# EAGLE design mp3-trigger (EAGLE 7.2.0)

## Sheet 1 of 2
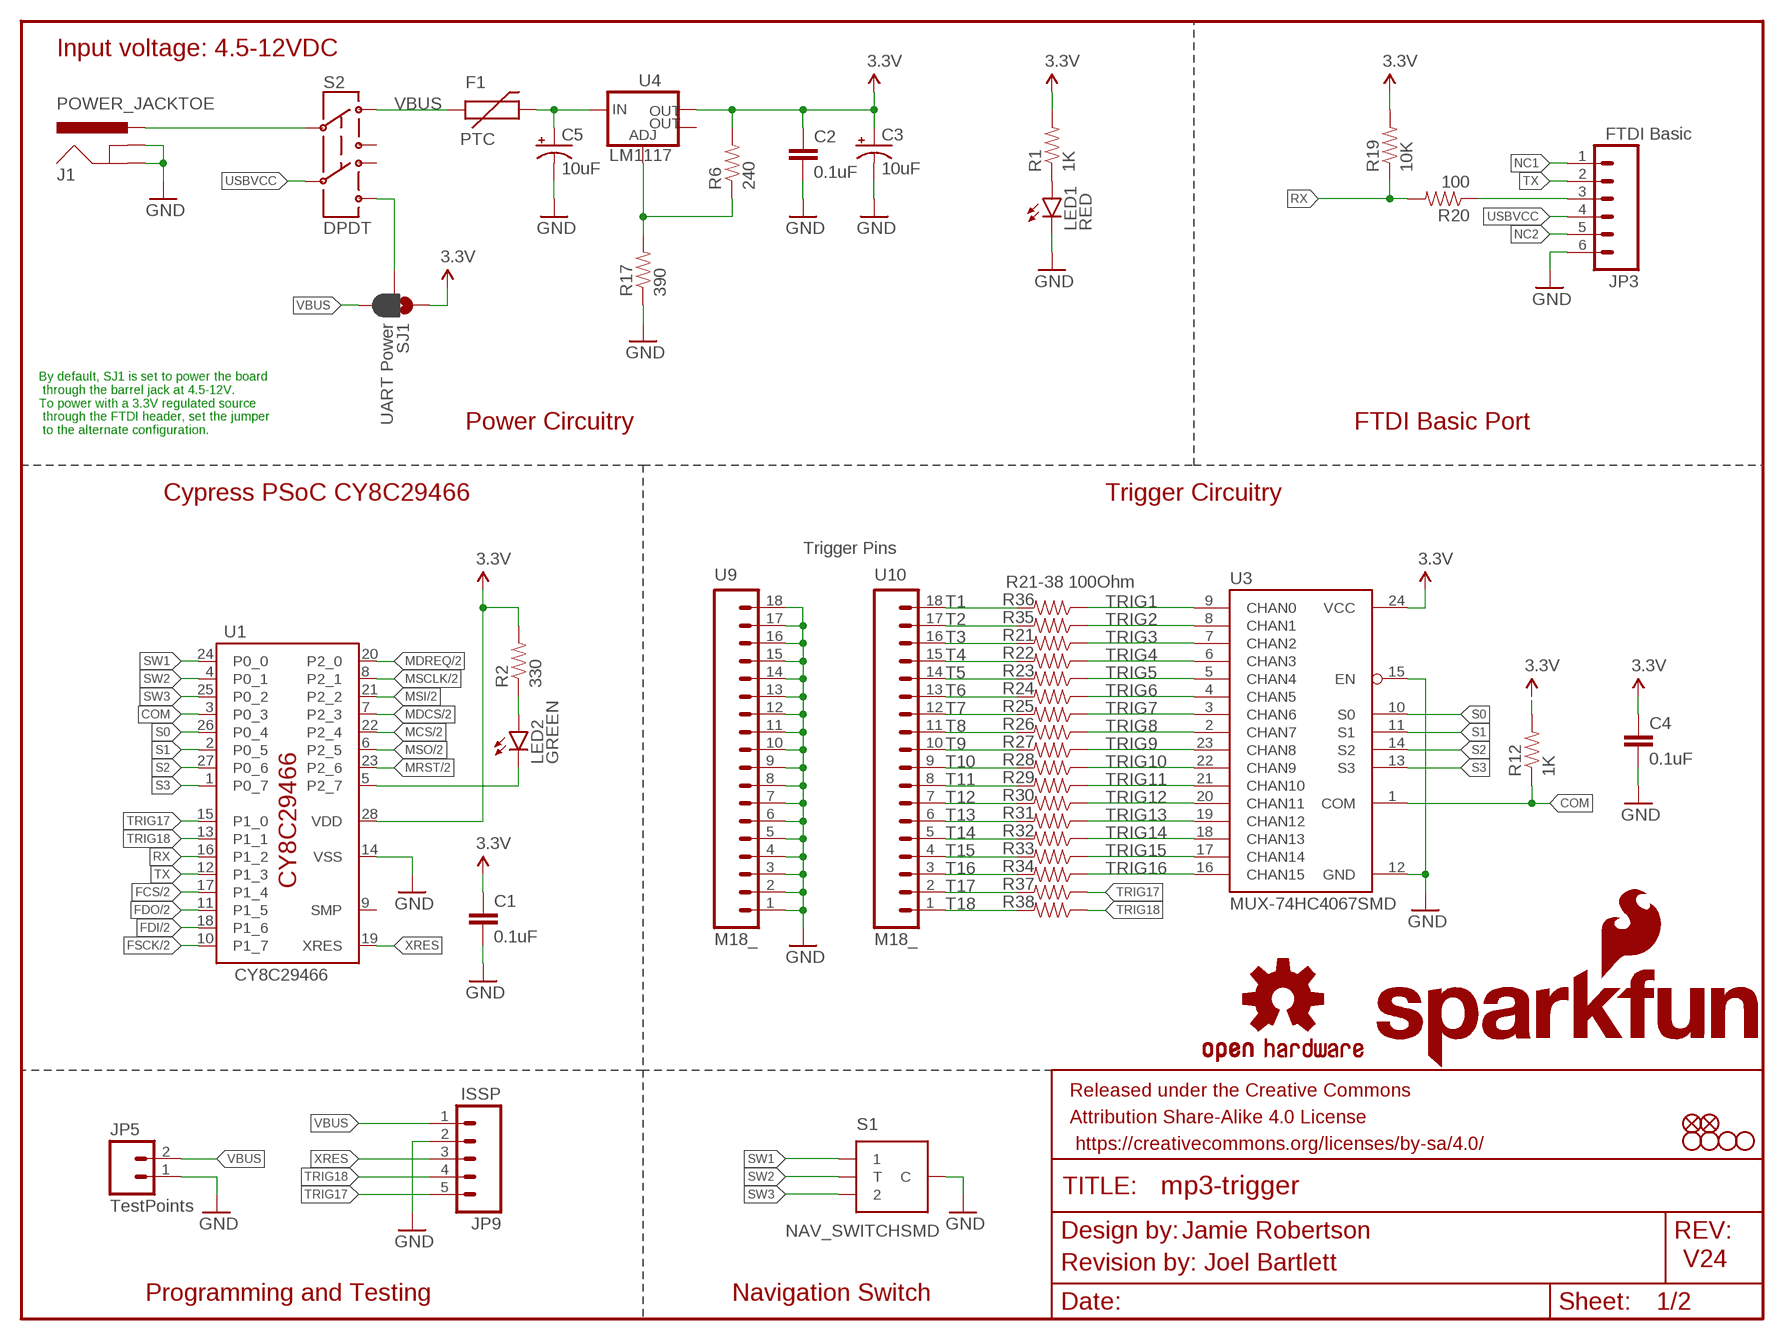
[diagram p0: schematic, sheet 1]

### Parts
C1  0.1uF  0.1UF-25V(+80/-20%)(0603)  [0603-CAP]
C2  0.1uF  0.1UF-25V(+80/-20%)(0603)  [0603-CAP]
C3  10uF  10UF-16V-10%(TANT)  [EIA3216]
C4  0.1uF  0.1UF-25V(+80/-20%)(0603)  [0603-CAP]
C5  10uF  10UF-16V-10%(TANT)  [EIA3216]
F1  PTC  PTCTHERMISTOR1206  [PTC-1206]
FRAME3  FRAME-LETTER  [CREATIVE_COMMONS]
J1  POWER_JACKTOE  [POWER_JACK_SMD_OVERPASTE_TOE]
JP3  FTDI Basic  M06SIP  [1X06]
JP5  TestPoints  M02PTH  [1X02]
JP6  FIDUCIAL1X2  [FIDUCIAL-1X2]
JP7  FIDUCIAL1X2  [FIDUCIAL-1X2]
JP9  ISSP  M05PTH  [1X05]
LED1  RED  LED-RED1206  [LED-1206]
LED2  GREEN  LED-GREEN1206  [LED-1206]
LOGO3  OSHW-LOGOM  [OSHW-LOGO-M]
R1  1K  1KOHM-1/10W-1%(0603)  [0603-RES]
R2  330  330OHM1/10W1%(0603)  [0603-RES]
R6  240  240OHM1/10W1%(0603)  [0603-RES]
R12  1K  1KOHM-1/10W-1%(0603)  [0603-RES]
R17  390  390OHM1/10W1%(0603)  [0603-RES]
R19  10K  10KOHM-1/10W-1%(0603)0603  [0603-RES]
R20  100  100OHM-1/10W-1%(0603)  [0603-RES]
R21  100  100OHM-1/10W-1%(0603)  [0603-RES]
R22  100  100OHM-1/10W-1%(0603)  [0603-RES]
R23  100  100OHM-1/10W-1%(0603)  [0603-RES]
R24  100  100OHM-1/10W-1%(0603)  [0603-RES]
R25  100  100OHM-1/10W-1%(0603)  [0603-RES]
R26  100  100OHM-1/10W-1%(0603)  [0603-RES]
R27  100  100OHM-1/10W-1%(0603)  [0603-RES]
R28  100  100OHM-1/10W-1%(0603)  [0603-RES]
R29  100  100OHM-1/10W-1%(0603)  [0603-RES]
R30  100  100OHM-1/10W-1%(0603)  [0603-RES]
R31  100  100OHM-1/10W-1%(0603)  [0603-RES]
R32  100  100OHM-1/10W-1%(0603)  [0603-RES]
R33  100  100OHM-1/10W-1%(0603)  [0603-RES]
R34  100  100OHM-1/10W-1%(0603)  [0603-RES]
R35  100  100OHM-1/10W-1%(0603)  [0603-RES]
R36  100  100OHM-1/10W-1%(0603)  [0603-RES]
R37  100  100OHM-1/10W-1%(0603)  [0603-RES]
R38  100  100OHM-1/10W-1%(0603)  [0603-RES]
S1  NAV_SWITCHSMD  [NAV_SWITCH]
S2  DPDT  SWITCH-DPDTAYZ0202  [AYZ0202]
SJ1  UART Power  JUMPER-PAD-3-2OF3_NC_BY_PASTE  [PAD-JUMPER-3-2OF3_NC_BY_PASTE_YES_SILK_FULL_BOX]
U1  CY8C29466  CY8C29466-24  [SOIC-28]
U3  MUX-74HC4067SMD  [SSOP24]
U4  LM1117  V_REG_LM1117SOT223  [SOT223]
U9  M18_  [1X18]
U10  M18_  [1X18]
U$1  SFE_LOGO_NAME_FLAME.2_INCH  [SFE_LOGO_NAME_FLAME_.2]
U$12  STAND-OFF  [STAND-OFF]
U$13  STAND-OFF  [STAND-OFF]
U$14  STAND-OFF  [STAND-OFF]
U$15  STAND-OFF  [STAND-OFF]

### Nets
3.3V: C1.1 C2.1 C3.A(+) C4.1 R1.2 R2.2 R6.2 R12.2 R19.2 SJ1.1 U1.28(VDD) U3.24(VCC) U4.2(OUT) ; also sheet 2
COM: R12.1 U1.3(P0_3) U3.1(COM)
FCS: U1.17(P1_4) ; also sheet 2
FDI: U1.18(P1_6) ; also sheet 2
FDO: U1.11(P1_5) ; also sheet 2
FSCK: U1.10(P1_7) ; also sheet 2
GND: C1.2 C2.2 C3.C(-) C4.2 C5.C(-) J1.GND(GNDBREAK) J1.P$4(GND) JP3.6 JP5.1 JP9.2 LED1.C R17.1 S1.C U1.14(VSS) U3.12(GND) U3.15(EN) U9.1 U9.2 U9.3 U9.4 U9.5 U9.6 U9.7 U9.8 U9.9 U9.10 U9.11 U9.12 U9.13 U9.14 U9.15 U9.16 U9.17 U9.18 ; also sheet 2
MCS: U1.22(P2_4) ; also sheet 2
MDCS: U1.7(P2_3) ; also sheet 2
MDREQ: U1.20(P2_0) ; also sheet 2
MRST: U1.23(P2_6) ; also sheet 2
MSCLK: U1.8(P2_1) ; also sheet 2
MSI: U1.21(P2_2) ; also sheet 2
MSO: U1.6(P2_5) ; also sheet 2
N$2: R6.1 R17.2 U4.1(ADJ)
N$4: LED1.A R1.1
N$9: LED2.A R2.1
N$12: LED2.C U1.5(P2_7)
N$13: J1.VIN0(PWR) S2.2
N$18: C5.A(+) F1.2 U4.3(IN)
N$20: S2.6 SJ1.2
NC1: JP3.1
NC2: JP3.5
RX: R19.1 R20.2 U1.16(P1_2)
RX-I: JP3.3 R20.1
S0: U1.26(P0_4) U3.10(S0)
S1: U1.2(P0_5) U3.11(S1)
S2: U1.27(P0_6) U3.14(S2)
S3: U1.1(P0_7) U3.13(S3)
SW1: S1.1 U1.24(P0_0)
SW2: S1.T U1.4(P0_1)
SW3: S1.2 U1.25(P0_2)
T1: R36.2 U10.18
T2: R35.2 U10.17
T3: R21.2 U10.16
T4: R22.2 U10.15
T5: R23.2 U10.14
T6: R24.2 U10.13
T7: R25.2 U10.12
T8: R26.2 U10.11
T9: R27.2 U10.10
T10: R28.2 U10.9
T11: R29.2 U10.8
T12: R30.2 U10.7
T13: R31.2 U10.6
T14: R32.2 U10.5
T15: R33.2 U10.4
T16: R34.2 U10.3
T17: R37.2 U10.2
T18: R38.2 U10.1
TRIG1: R36.1 U3.9(CHAN0)
TRIG2: R35.1 U3.8(CHAN1)
TRIG3: R21.1 U3.7(CHAN2)
TRIG4: R22.1 U3.6(CHAN3)
TRIG5: R23.1 U3.5(CHAN4)
TRIG6: R24.1 U3.4(CHAN5)
TRIG7: R25.1 U3.3(CHAN6)
TRIG8: R26.1 U3.2(CHAN7)
TRIG9: R27.1 U3.23(CHAN8)
TRIG10: R28.1 U3.22(CHAN9)
TRIG11: R29.1 U3.21(CHAN10)
TRIG12: R30.1 U3.20(CHAN11)
TRIG13: R31.1 U3.19(CHAN12)
TRIG14: R32.1 U3.18(CHAN13)
TRIG15: R33.1 U3.17(CHAN14)
TRIG16: R34.1 U3.16(CHAN15)
TRIG17: JP9.5 R37.1 U1.15(P1_0)
TRIG18: JP9.4 R38.1 U1.13(P1_1)
TX: JP3.2 U1.12(P1_3)
USBVCC: JP3.4 S2.5
VBUS: F1.1 JP5.2 JP9.1 S2.1 SJ1.3
XRES: JP9.3 U1.19(XRES)
Unconnected: S2.3 S2.4 U1.9(SMP) U4.4(OUT)

### Notes on the sheet
- Input voltage: 4.5-12VDC
- Power Circuitry | FTDI Basic Port
- By default, SJ1 is set to power the board
   through the barrel jack at 4.5-12V. 
  To power with a 3.3V regulated source
   through the FTDI header, set the jumper
   to the alternate configuration.
- Cypress PSoC CY8C29466 | Trigger Circuitry
- Trigger Pins
- R21-38 100Ohm
- Jamie Robertson
- Revision by: Joel Bartlett | V24
- Programming and Testing | Navigation Switch

## Sheet 2 of 2
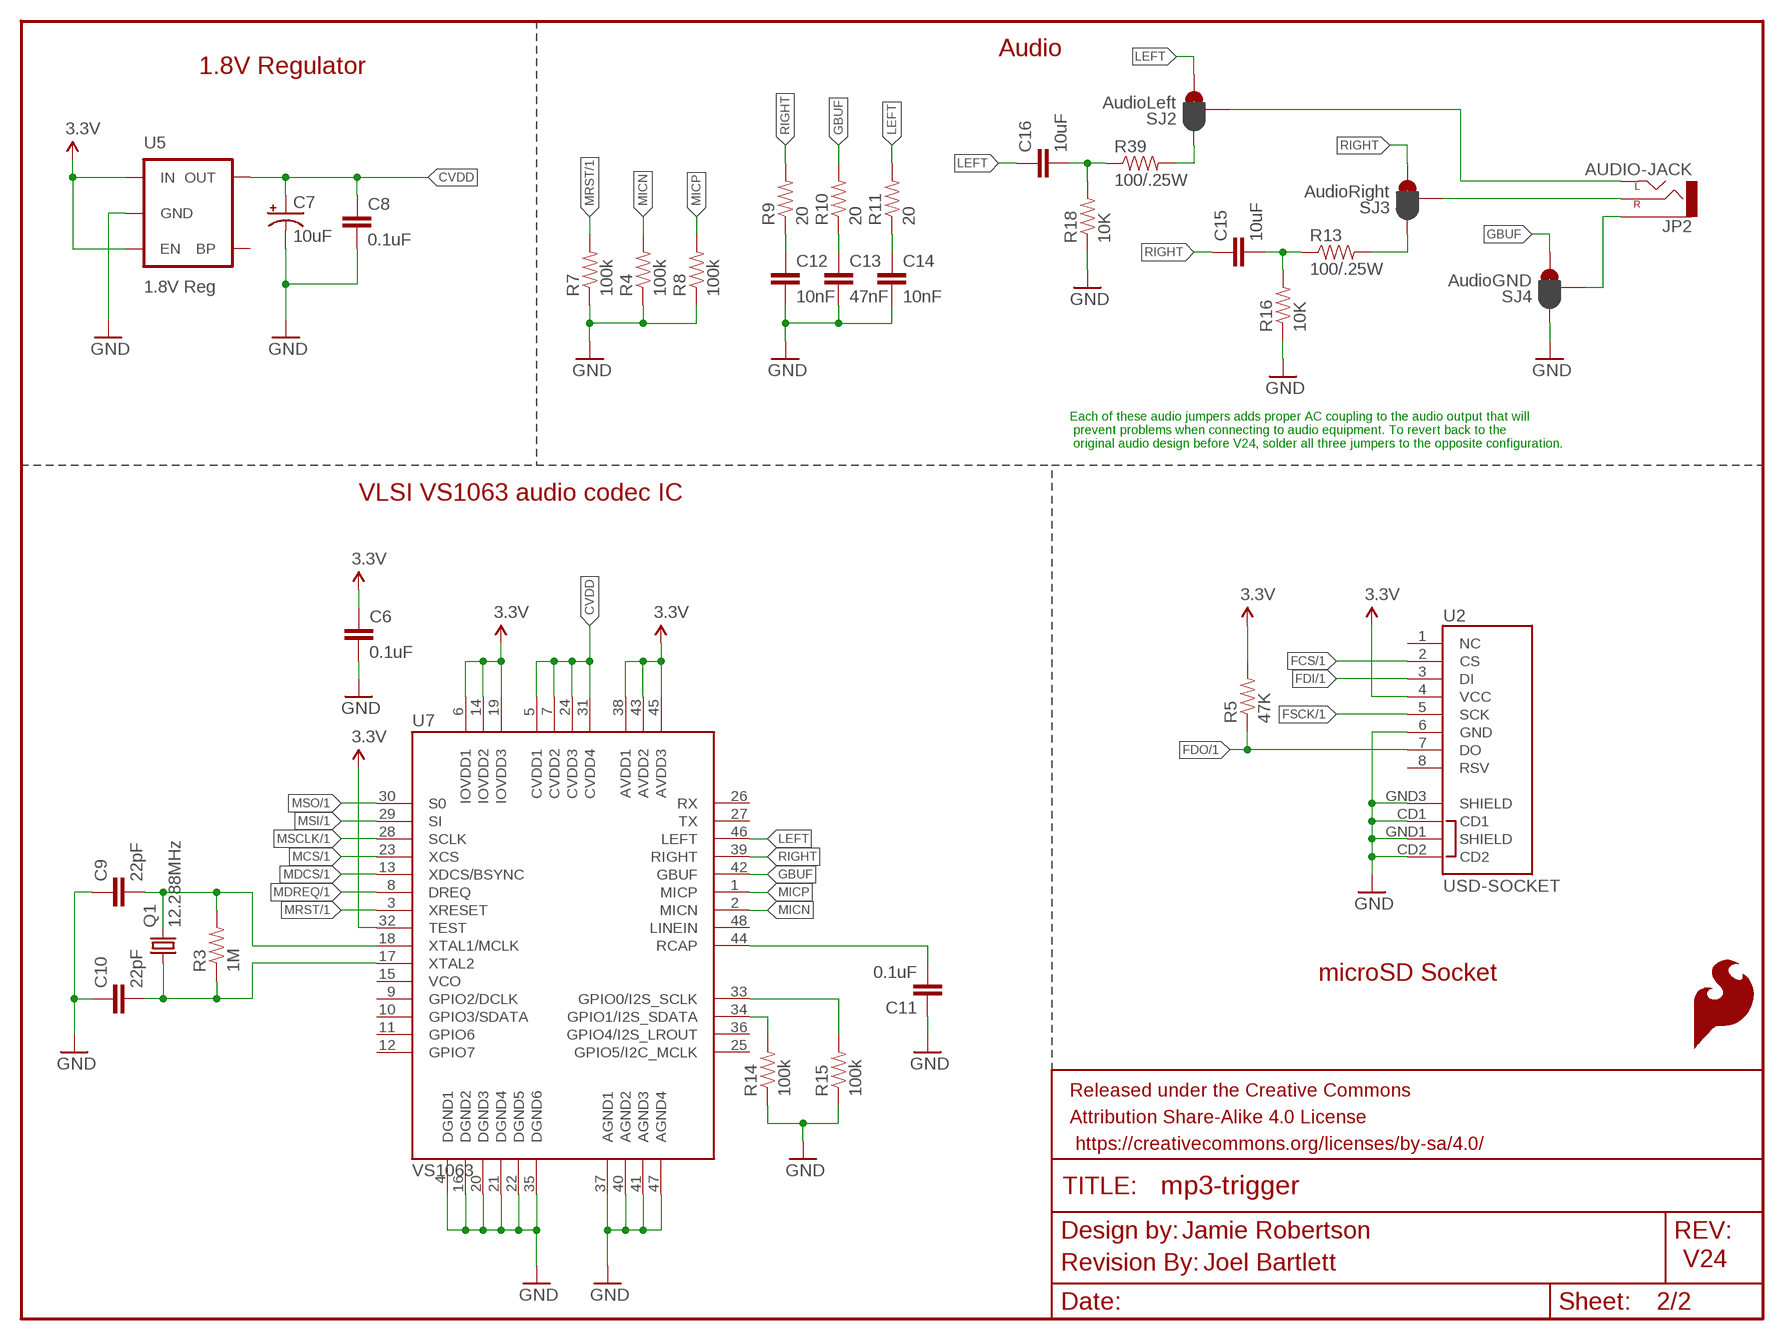
[diagram p1: schematic, sheet 2]

### Parts
C6  0.1uF  0.1UF-25V(+80/-20%)(0603)  [0603-CAP]
C7  10uF  10UF-16V-10%(TANT)  [EIA3216]
C8  0.1uF  0.1UF-25V(+80/-20%)(0603)  [0603-CAP]
C9  22pF  22PF-50V-5%(0603)  [0603-CAP]
C10  22pF  22PF-50V-5%(0603)  [0603-CAP]
C11  0.1uF  0.1UF-25V(+80/-20%)(0603)  [0603-CAP]
C12  10nF  10NF/10000PF-50V-10%(0603)  [0603-CAP]
C13  47nF  47NF(0.047UF/47000PF)-25V-5%(0603)SMD  [0603-CAP]
C14  10nF  10NF/10000PF-50V-10%(0603)  [0603-CAP]
C15  10uF  10UF-6.3V-20%(0603)  [0603-CAP]
C16  10uF  10UF-6.3V-20%(0603)  [0603-CAP]
FRAME1  FRAME-LETTERNO_PACKAGE  [DUMMY]
JP2  AUDIO-JACK  AUDIO-JACKSMD2  [AUDIO-JACK-3.5MM-SMD]
LOGO1  SFE_LOGO_FLAME.3_INCH  [SFE_LOGO_FLAME_.3]
Q1  12.288MHz  CRYSTALCRYSTAL-SMD-5X3-12.288MHZ  [CRYSTAL-SMD-5X3]
R3  1M  1MOHM-1/10W-1%(0603)  [0603-RES]
R4  100k  100KOHM-1/10W-1%(0603)  [0603-RES]
R5  47K  47KOHM1/10W1%(0603)  [0603-RES]
R7  100k  100KOHM-1/10W-1%(0603)  [0603-RES]
R8  100k  100KOHM-1/10W-1%(0603)  [0603-RES]
R9  20  20OHM1/10W1%(0603)SMD  [0603-RES]
R10  20  20OHM1/10W1%(0603)SMD  [0603-RES]
R11  20  20OHM1/10W1%(0603)SMD  [0603-RES]
R13  100/.25W  100OHM-1/4W-5%(0603)  [0603-RES]
R14  100k  100KOHM-1/10W-1%(0603)  [0603-RES]
R15  100k  100KOHM-1/10W-1%(0603)  [0603-RES]
R16  10K  10KOHM-1/10W-1%(0603)0603  [0603-RES]
R18  10K  10KOHM-1/10W-1%(0603)0603  [0603-RES]
R39  100/.25W  100OHM-1/4W-5%(0603)  [0603-RES]
SJ2  AudioLeft  JUMPER_PAD-3-1&2_NC_BY_PASTE  [PAD-HUMPER-3-1&2_NC_BY_PASTE_YES_SILK_FULL_BOX]
SJ3  AudioRight  JUMPER_PAD-3-1&2_NC_BY_PASTE  [PAD-HUMPER-3-1&2_NC_BY_PASTE_YES_SILK_FULL_BOX]
SJ4  AudioGND  JUMPER_PAD-3-1&2_NC_BY_PASTE  [PAD-HUMPER-3-1&2_NC_BY_PASTE_YES_SILK_FULL_BOX]
U2  USD-SOCKET  [MICROSD_1:1]
U5  1.8V Reg  V_REG_LDOSMD2  [SC70]
U7  VS1063  VS1063SMD  [LQFP-48]
U$4  REVISION  [REVISION]

### Nets
3.3V: C6.1 R5.2 U2.4(VCC) U5.1(IN) U5.3(EN) U7.6(IOVDD1) U7.14(IOVDD2) U7.19(IOVDD3) U7.32(TEST) U7.38(AVDD1) U7.43(AVDD2) U7.45(AVDD3) ; also sheet 1
CVDD: C7.A(+) C8.1 U5.5(OUT) U7.5(CVDD1) U7.7(CVDD2) U7.24(CVDD3) U7.31(CVDD4)
FCS: U2.2(CS) ; also sheet 1
FDI: U2.3(DI) ; also sheet 1
FDO: R5.1 U2.7(DO) ; also sheet 1
FSCK: U2.5(SCK) ; also sheet 1
GBUF: R10.2 SJ4.3 U7.42(GBUF)
GND: C6.2 C7.C(-) C8.2 C9.1 C10.1 C11.1 C12.2 C13.2 C14.2 R4.1 R7.1 R8.1 R14.1 R15.1 R16.1 R18.1 SJ4.1 U2.6(GND) U2.CD1 U2.CD2 U2.GND1(SHIELD) U2.GND3(SHIELD) U5.2(GND) U7.4(DGND1) U7.16(DGND2) U7.20(DGND3) U7.21(DGND4) U7.22(DGND5) U7.35(DGND6) U7.37(AGND1) U7.40(AGND2) U7.41(AGND3) U7.47(AGND4) ; also sheet 1
LEFT: C16.1 R11.2 SJ2.3 U7.46(LEFT)
MCS: U7.23(XCS) ; also sheet 1
MDCS: U7.13(XDCS/BSYNC) ; also sheet 1
MDREQ: U7.8(DREQ) ; also sheet 1
MICN: R4.2 U7.2(MICN)
MICP: R8.2 U7.1(MICP)
MRST: R7.2 U7.3(XRESET) ; also sheet 1
MSCLK: U7.28(SCLK) ; also sheet 1
MSI: U7.29(SI) ; also sheet 1
MSO: U7.30(S0) ; also sheet 1
N$1: JP2.SLEEVE SJ4.2
N$3: C9.2 Q1.3 R3.2 U7.18(XTAL1/MCLK)
N$5: C10.2 Q1.1 R3.1 U7.17(XTAL2)
N$6: JP2.RING(RIGHT) SJ3.2
N$7: R13.2 SJ3.1
N$8: C15.2 R13.1 R16.2
N$10: R14.2 U7.34(GPIO1/I2S_SDATA)
N$11: C11.2 U7.44(RCAP)
N$14: C14.1 R11.1
N$15: C13.1 R10.1
N$16: C12.1 R9.1
N$17: R15.2 U7.33(GPIO0/I2S_SCLK)
N$19: JP2.TIP(LEFT) SJ2.2
N$22: R39.2 SJ2.1
N$23: C16.2 R18.2 R39.1
RIGHT: C15.1 R9.2 SJ3.3 U7.39(RIGHT)
Unconnected: U2.1(NC) U2.8(RSV) U5.4(BP) U7.9(GPIO2/DCLK) U7.10(GPIO3/SDATA) U7.11(GPIO6) U7.12(GPIO7) U7.15(VCO) U7.25(GPIO5/I2C_MCLK) U7.26(RX) U7.27(TX) U7.36(GPIO4/I2S_LROUT) U7.48(LINEIN)

### Notes on the sheet
- Audio
- 1.8V Regulator
- Each of these audio jumpers adds proper AC coupling to the audio output that will
   prevent problems when connecting to audio equipment. To revert back to the
   original audio design before V24, solder all three jumpers to the opposite configuration.
- VLSI VS1063 audio codec IC
- microSD Socket
- Jamie Robertson
- Joel Bartlett | V24

## Library data of the parts
C1 C2 C4 C6 C8 C11 = SparkFun-Capacitors:0.1UF-25V(+80/-20%)(0603): CAP-00810 Ceramic Standard decoupling cap; PROD_ID: CAP-00810
C3 C5 C7 = SparkFun-Capacitors:10UF-16V-10%(TANT): CAP-00811 1206/EIA-3216 Tantalum capacitor; PROD_ID: CAP-00811
C9 C10 = SparkFun-Capacitors:22PF-50V-5%(0603): CAP-07876; PROD_ID: CAP-07876
C12 C14 = SparkFun-Capacitors:10NF/10000PF-50V-10%(0603): CAP-00867; PROD_ID: CAP-00867
C13 = SparkFun-Capacitors:47NF(0.047UF/47000PF)-25V-5%(0603): CAP-08605; PROD_ID: CAP-08605
C15 C16 = SparkFun-Capacitors:10UF-6.3V-20%(0603): CAP-11015; PROD_ID: CAP-11015
F1 = SparkFun-PowerIC:PTC: Resettable Fuse PTC Resettable Fuse. Spark Fun Electronics SKU : COM-08357; PROD_ID: RES-08585
FRAME1 = SparkFun-Aesthetics:FRAME-LETTER: Schematic Frame Standard 8.5x11 US Letter frame; DESIGNER: Nobody; VERSION: v01
FRAME3 = SparkFun-Aesthetics:FRAME-LETTER: Schematic Frame Standard 8.5x11 US Letter frame
J1 = SparkFun-Connectors:POWER_JACK: Power Jack This is the standard 5.5mm barrel jack for power. The PTH is the most common, proven, reliable, footprint. The Slot footprint only works if the mill layer is transmitted to the PCB fab house so be warned. Mating wall wart : TOL-00298 (and others); PROD_ID: CONN-08106; SF_ID: PRT-12748
JP2 = SparkFun-Connectors:AUDIO-JACK: 3.5mm Audio Jack Simple 3.5mm common PCB mount audio jack. Variant PTH is our storefront SKU PRT-08032; PROD_ID: CONN-10353
JP3 = SparkFun:M06: Header 6 Standard 6-pin 0.1" header. Use with straight break away headers (SKU : PRT-00116), right angle break away headers (PRT-00553), swiss pins (PRT-00743), machine pins (PRT-00117), and female headers (PRT-00115). Molex polarized connector foot print use with SKU : PRT-08094 with associated crimp pins and housings. NOTES ON THE VARIANTS LOCK and LOCK_LONGPADS... This footprint was designed to help hold the alignment of a through-hole component (i.e. 6-pin header) while soldering it into place. You may notice that each hole has been shifted either up or down by 0.005 of an inch from it's more standard position (which is a perfectly straight line). This slight alteration caused the pins (the squares in the middle) to touch the edges of the holes. Because they are alternating, it causes a "brace" to hold the component in place. 0.005 has proven to be the perfect amount of "off-center" position when using our standard breakaway headers. Although looks a little odd when you look at the bare footprint, once you have a header in there, the alteration is very hard to notice. Also, if you push a header all the way into place, it is covered up entirely on the bottom side. This idea of altering the position of holes to aid alignment will be further integrated into the Sparkfun Library for other footprints. It can help hold any component with 3 or more connection pins.
JP5 = SparkFun:M02: Header 2 Standard 2-pin 0.1" header. Use with straight break away headers (SKU : PRT-00116), right angle break away headers (PRT-00553), swiss pins (PRT-00743), machine pins (PRT-00117), and female headers (PRT-00115). Molex polarized connector foot print use with SKU : PRT-08233 with associated crimp pins and housings.
JP6 JP7 = SparkFun-Aesthetics:FIDUCIAL: Fiducial Alignment Points Various fiducial points for machine vision alignment.
JP9 = SparkFun:M05: Header 5 Standard 5-pin 0.1" header. Use with straight break away headers (SKU : PRT-00116), right angle break away headers (PRT-00553), swiss pins (PRT-00743), machine pins (PRT-00117), and female headers (PRT-00115). Molex polarized connector foot print use with SKU : PRT-08230 with associated crimp pins and housings.
LED1 = SparkFun-LED:LED-RED: Assorted Red LEDs LilyPad 1206- DIO-09912 1206- DIO-00809 0603- DIO-00819 "SMART" means more efficient and expensive; PROD_ID: DIO-09912
LED2 = SparkFun-LED:LED-GREEN: Various green LEDs Green LEDs used in SFE Production 0603- DIO-00821 LARGE- DIO-00862 LILYPAD- DIO-09910; PROD_ID: DIO-00862
LOGO1 = SparkFun-Aesthetics:SFE_LOGO_FLAME: SFE Logo, flame only This is the SparkFun flame logo. The logo on the schematic will always be the same size; the package variant is the height of the flame. Default layer for the logo on the board is tSilk.
LOGO3 = SparkFun-Aesthetics:OSHW-LOGO: Open Source Hardware Logo This logo indicates the piece of hardware it is found on incorporates a OSHW license and/or adheres to the definition of open source hardware found here: http://freedomdefined.org/OSHW
Q1 = SparkFun-FreqCtrl:CRYSTAL: Various standard crystals. Proven footprints.; PROD_ID: XTAL-09653
R1 R12 = SparkFun-Resistors:1KOHM-1/10W-1%(0603): RES-07856; PROD_ID: RES-07856
R2 = SparkFun-Resistors:330OHM1/10W1%(0603): RES-00818; PROD_ID: RES-00818
R3 = SparkFun-Resistors:1MOHM-1/10W-1%(0603): RES-07868; PROD_ID: RES-07868
R4 R7 R8 R14 R15 = SparkFun-Resistors:100KOHM-1/10W-1%(0603): RES-07828; PROD_ID: RES-07828
R5 = SparkFun-Resistors:47KOHM1/10W1%(0603): RES-07871; PROD_ID: RES-07871
R6 = SparkFun-Resistors:240OHM1/10W1%(0603): RES-07849; PROD_ID: RES-07849
R9-R11 = SparkFun-Resistors:20OHM1/10W1%(0603): RES-07862; PROD_ID: RES-07862
R13 R39 = SparkFun-Resistors:100OHM-1/4W-5%(0603); PROD_ID: RES-12438
R16 R18 R19 = SparkFun-Resistors:10KOHM-1/10W-1%(0603): RES-00824; PROD_ID: RES-00824
R17 = SparkFun-Resistors:390OHM1/10W1%(0603): RES-07864; PROD_ID: RES-07864
R20-R38 = SparkFun-Resistors:100OHM-1/10W-1%(0603): RES-07863; PROD_ID: RES-07863
S1 = SparkFun-Electromechanical:NAV_SWITCH: Navigation Switch Three way navigation switch. Commonly used as up/down/select on MP3 players. Schematic element and footprint production proven. Spark Fun Electronics SKU : COM-08184; PROD_ID: SWCH-08301
S2 = SparkFun-Electromechanical:SWITCH-DPDT: DPDT Version of the COM-00597; PROD_ID: SWCH-08179
SJ1 = SparkFun-Passives:JUMPER-PAD-3-2OF3_NC_BY_PASTE
SJ2-SJ4 = SparkFun-Passives:JUMPER_PAD-3-1&2_NC_BY_PASTE
U1 = SparkFun-DigitalIC:CY8C29466-24*: CYPRESS MCU 32K FLASH 2K SRAM 28-SOIC; PROD_ID: IC-08972
U2 = SparkFun-Connectors:USD-SOCKET: microSD Socket Push-push type uSD socket. Schematic element and footprint production proven. Spark Fun Electronics SKU : PRT-00127. tDoc lines correctly indicate media card edge positions when inserting (unlocked, locked, depressed). NOTE: CD1 and CD2 are connected internally; PROD_ID: CONN-07820
U3 = SparkFun-AnalogIC:MUX-74HC4067: 16-channel analog MUX; PROD_ID: IC-08252
U4 = SparkFun-PowerIC:V_REG_LM1117: Voltage Regulator LM1117 Standard adjustable voltage regulator but in SMD form. Spark Fun Electronics SKU : COM-00595; PROD_ID: VREG-08170
U5 = SparkFun-PowerIC:V_REG_LDO: Voltage Regulator LDO Standard 150mA LDO voltage regulator in SOT-23 layout. Micrel part MIC5205. BP (by-pass) pin is used to lower output noise with 470pF cap.; PROD_ID: VREG-08428
U7 = SparkFun-DigitalIC:VS1063; PROD_ID: IC-10870
U9 U10 = SparkFun:M18
U$1 = SparkFun-Aesthetics:SFE_LOGO_NAME_FLAME: SFE Logo, name and flame This is the SparkFun full logo. The logo on the schematic will always be the same size; the package variant is the height of the flame part of the logo. Default layer for the logo on the board is tSilk.
U$4 = SparkFun-Aesthetics:REVISION
U$12-U$15 = SparkFun-Electromechanical:STAND-OFF: #4 Stand Off This is the mechanical footprint for a #4 phillips button head screw. Use the keepout ring to avoid running the screw head into surrounding components. SKU : PRT-00447

## Net classes
1 +5v: width 0.813 mm
2 GND: width 0.813 mm

## Board
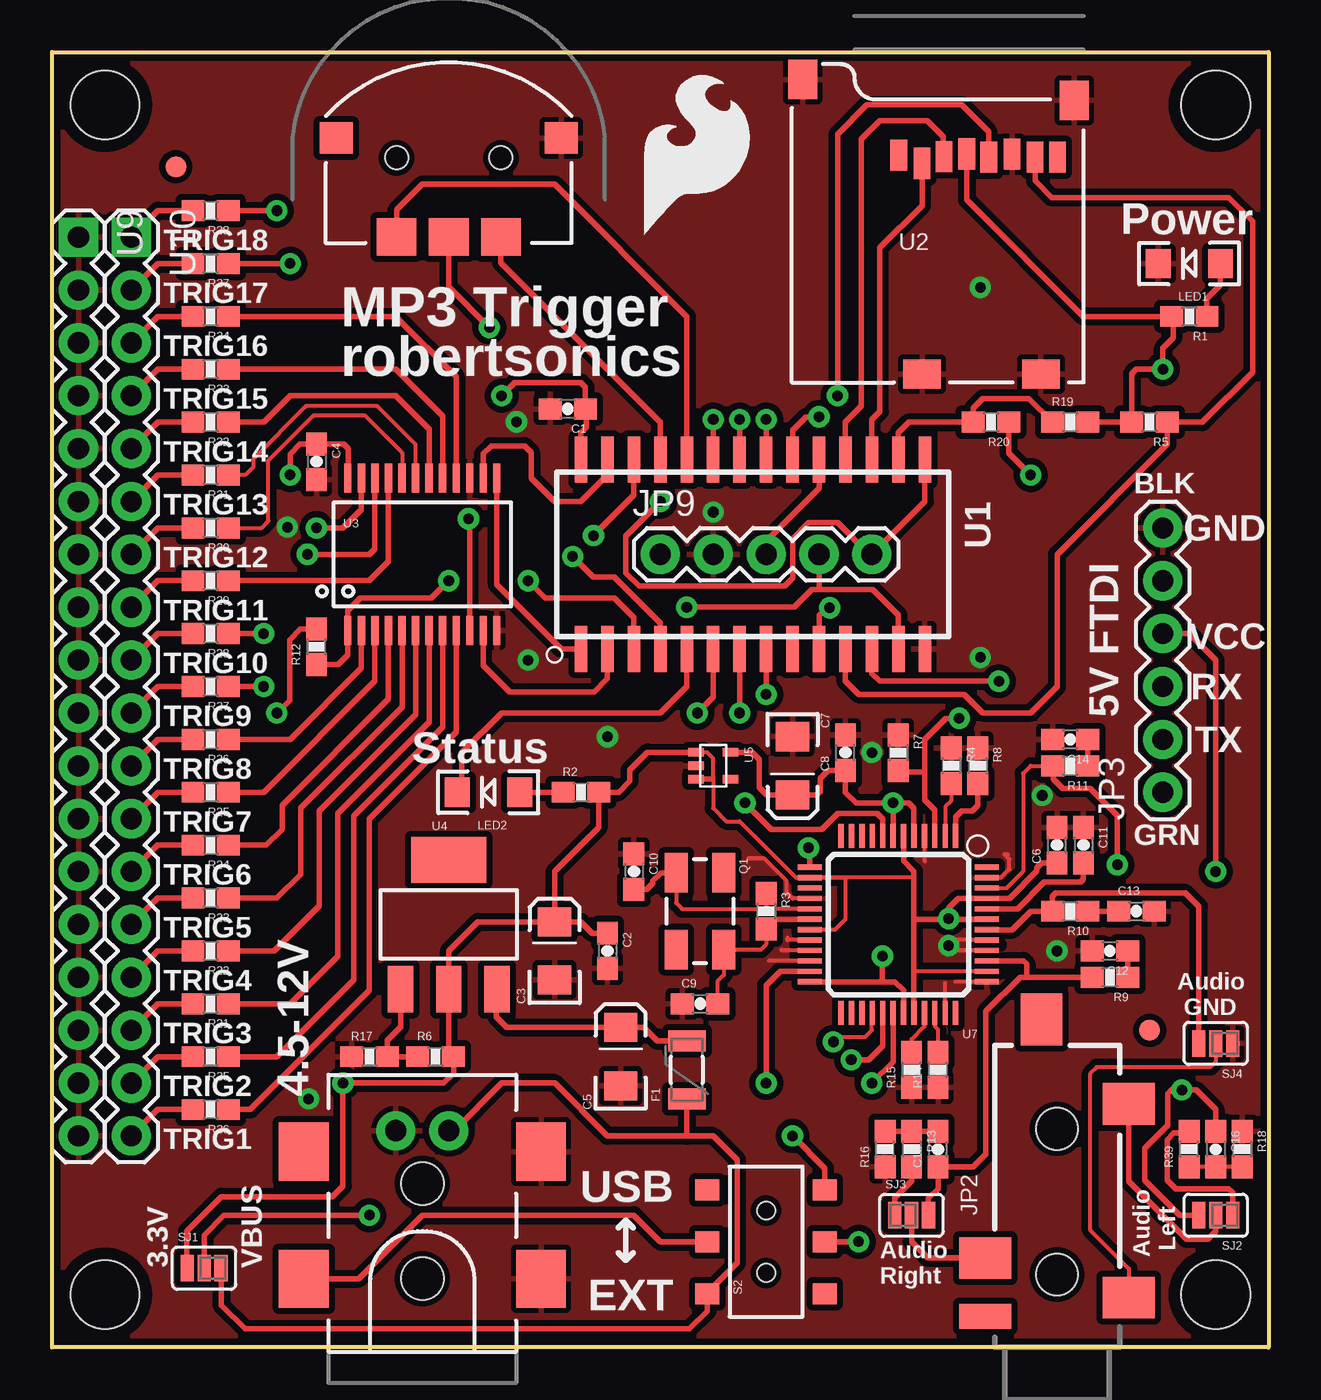
[diagram p2: board, top side]
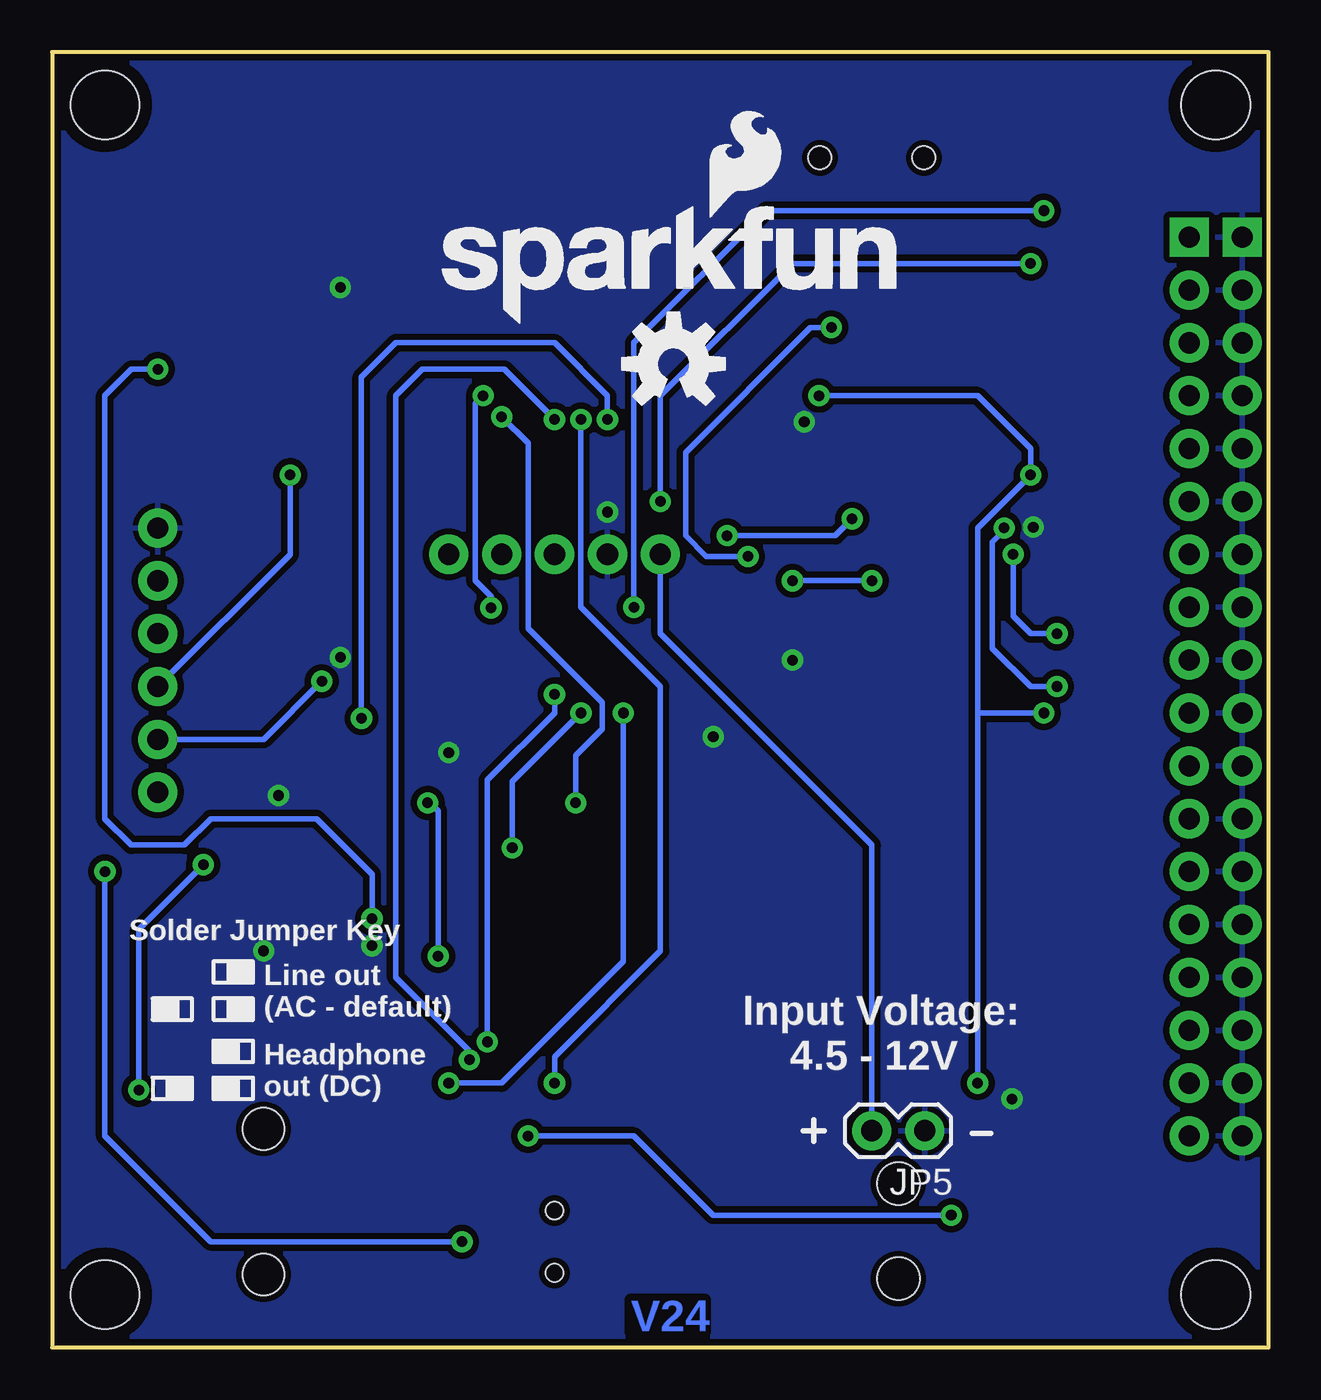
[diagram p3: board, bottom side, seen from below]

Size 58.42 x 62.23 mm. Coordinates in mm from the lower left corner, seen from the top.
Outline: 0,0 0,62.23 58.42,62.23 58.42,0 0,0
Copper layers (1*16): Top 0.035mm / dielectric 1.5mm / Bottom 0.035mm
Design rules "SparkFun-2-layer": minimum track width 7mil, minimum drill 15mil, track to track 8mil, track to pad 8mil, pad to pad 8mil, via to via 8mil, smd to smd 8mil, copper to edge 8mil, drill to drill 8mil, minimum pad ring 12mil, minimum via ring 10mil, stop-mask expansion 4mil, vias tented up to drill 20mil, thermal gap 10mil

### Footprints (pad centres in the part's own frame; a part is rotated, then mirrored left to right if it is on the bottom)
0603-CAP = smd 1.1 x 1: 1 -0.85,0; 2 0.85,0
EIA3216 = smd 1.4 x 1.6: A 1.4,0; C -1.4,0
PTC-1206 = smd 1 x 1.8: 1 -1.4,0; 2 1.4,0
POWER_JACK_SMD_OVERPASTE_TOE = smd 2.8 x 2.4: GND 0,-5.7; P$4 6.1,-5.7; VIN0 0,5.7; VIN1 6.1,5.7 | hole 2.032: 0,0; 4.572,0
AUDIO-JACK-3.5MM-SMD = smd 2 x 2.5: RING 4.3,3.45; SLEEVE 2.4,-3.45; TIP 11.7,-3.45 | smd 1.2 x 2.5: RSH 1.5,3.45 | smd 2.5 x 2: TSH 15.75,0.75 | hole 2: 3.5,0; 10.5,0
1X06 = drill 1.016 pad 1.88: 1 0,0; 2 2.54,0; 3 5.08,0; 4 7.62,0; 5 10.16,0; 6 12.7,0
1X02 = drill 1.016 pad 1.88: 1 0,0; 2 2.54,0
FIDUCIAL-1X2 = smd 1 x 1: 1 0,0
1X05 = drill 1.016 pad 1.88: 1 0,0; 2 2.54,0; 3 5.08,0; 4 7.62,0; 5 10.16,0
LED-1206 = smd 1.2 x 1.4: A -1.5,0; C 1.5,0
CRYSTAL-SMD-5X3 = smd 1.9 x 1.1: 1 -1.85,-1.15; 2 1.85,-1.15; 3 1.85,1.15; 4 -1.85,1.15
0603-RES = smd 1.1 x 1: 1 -0.85,0; 2 0.85,0
NAV_SWITCH = smd 1.9 x 1.8: 1 -2.5,-3.8; 2 2.5,-3.8; T 0,-3.8 | smd 1.6 x 1.5: C 5.4,0.95; NC -5.4,0.95 | hole 1.1: -2.5,0; 2.5,0
AYZ0202 = smd 1 x 1.15: 1 -2.5,2.825; 2 0,2.825; 3 2.5,2.825; 4 -2.5,-2.825; 5 0,-2.825; 6 2.5,-2.825 | hole 0.85: 1.5,0; -1.5,0
PAD-JUMPER-3-2OF3_NC_BY_PASTE_YES_SILK_FULL_BOX = smd 0.635 x 1.27: 1 -0.813,0; 2 0,0; 3 0.813,0
PAD-HUMPER-3-1&2_NC_BY_PASTE_YES_SILK_FULL_BOX = smd 0.635 x 1.27: 1 -0.813,0; 2 0,0; 3 0.813,0
SOIC-28 = smd 0.6 x 2.2: 1 8.89,4.548; 2 7.62,4.548; 3 6.35,4.548; 4 5.08,4.548; 5 3.81,4.548; 6 2.54,4.548; 7 1.27,4.548; 8 0,4.548; 9 -1.27,4.548; 10 -2.54,4.548; 11 -3.81,4.548; 12 -5.08,4.548; 13 -6.35,4.548; 14 -7.62,4.548; 15 -7.62,-4.548; 16 -6.35,-4.548; 17 -5.08,-4.548; 18 -3.81,-4.548; 19 -2.54,-4.548; 20 -1.27,-4.548; 21 0,-4.548; 22 1.27,-4.548; 23 2.54,-4.548; 24 3.81,-4.548; 25 5.08,-4.548; 26 6.35,-4.548; 27 7.62,-4.548; 28 8.89,-4.548
MICROSD_1:1 = smd 0.8 x 1.5: 1 5.096,10.919; 2 6.218,10.519; 3 7.274,10.853; 4 8.367,10.982; 5 9.421,10.828; 6 10.539,10.973; 7 11.648,10.819; 8 12.721,10.819 | smd 1.8 x 1.4: CD1 11.92,0.4; CD2 6.22,0.4 | smd 1.4 x 1.9: GND1 0.497,14.55; GND3 13.52,13.55
SSOP24 = smd 0.348 x 1.397: 1 -3.575,-3.656; 2 -2.925,-3.656; 3 -2.275,-3.656; 4 -1.625,-3.656; 5 -0.975,-3.656; 6 -0.325,-3.656; 7 0.325,-3.656; 8 0.975,-3.656; 9 1.625,-3.656; 10 2.275,-3.656; 11 2.925,-3.656; 12 3.575,-3.656; 13 3.575,3.656; 14 2.925,3.656; 15 2.275,3.656; 16 1.625,3.656; 17 0.975,3.656; 18 0.325,3.656; 19 -0.325,3.656; 20 -0.975,3.656; 21 -1.625,3.656; 22 -2.275,3.656; 23 -2.925,3.656; 24 -3.575,3.656
SOT223 = smd 1.219 x 2.235: 1 -2.311,-3.099; 2 0,-3.099; 3 2.311,-3.099 | smd 3.6 x 2.2: 4 0,3.099
SC70 = smd 0.4 x 0.75: 1 -0.65,-0.825; 2 0,-0.825; 3 0.65,-0.825; 4 0.65,0.825; 5 -0.65,0.825
LQFP-48 = smd 0.254 x 1.143: 1 -2.75,-4.25; 2 -2.25,-4.25; 3 -1.75,-4.25; 4 -1.25,-4.25; 5 -0.75,-4.25; 6 -0.25,-4.25; 7 0.25,-4.25; 8 0.75,-4.25; 9 1.25,-4.25; 10 1.75,-4.25; 11 2.25,-4.25; 12 2.75,-4.25; 25 2.75,4.25; 26 2.25,4.25; 27 1.75,4.25; 28 1.25,4.25; 29 0.75,4.25; 30 0.25,4.25; 31 -0.25,4.25; 32 -0.75,4.25; 33 -1.25,4.25; 34 -1.75,4.25; 35 -2.25,4.25; 36 -2.75,4.25 | smd 1.143 x 0.254: 13 4.25,-2.75; 14 4.25,-2.25; 15 4.25,-1.75; 16 4.25,-1.25; 17 4.25,-0.75; 18 4.25,-0.25; 19 4.25,0.25; 20 4.25,0.75; 21 4.25,1.25; 22 4.25,1.75; 23 4.25,2.25; 24 4.25,2.75; 37 -4.25,2.75; 38 -4.25,2.25; 39 -4.25,1.75; 40 -4.25,1.25; 41 -4.25,0.75; 42 -4.25,0.25; 43 -4.25,-0.25; 44 -4.25,-0.75; 45 -4.25,-1.25; 46 -4.25,-1.75; 47 -4.25,-2.25; 48 -4.25,-2.75
1X18 = drill 1.016 pad 1.88 square: 1 0,0 | drill 1.016 pad 1.88: 2 2.54,0; 3 5.08,0; 4 7.62,0; 5 10.16,0; 6 12.7,0; 7 15.24,0; 8 17.78,0; 9 20.32,0; 10 22.86,0; 11 25.4,0; 12 27.94,0; 13 30.48,0; 14 33.02,0; 15 35.56,0; 16 38.1,0; 17 40.64,0; 18 43.18,0
STAND-OFF = hole 3.302: 0,0

### Placement (x,y rotation side)
C1  24.77,45.09 180 top
C2  26.67,19.05 270 top
C3  24.13,19.05 90 top
C4  12.7,42.55 270 top
C5  27.3,13.97 90 top
C6  48.26,24.13 90 top
C7  35.56,27.94 270 top
C8  38.1,28.57 90 top
C9  31.11,16.51 0 top
C10  27.94,22.86 270 top
C11  49.53,24.13 270 top
C12  50.8,19.05 180 top
C13  52.07,20.95 0 top
C14  48.9,29.21 180 top
C15  42.55,9.53 90 top
C16  55.88,9.53 270 top
F1  30.48,13.34 90 top
FRAME1  -25.4,-20.32 0 top  (outside the outline)
FRAME3  -5.08,-16.51 0 top  (outside the outline)
J1  17.78,3.3 90 top
JP2  48.26,0 90 top
JP3  53.34,26.67 90 top
JP5  16.51,10.41 180 bottom
JP6  5.94,56.72 0 top
JP7  52.7,15.24 0 top
JP9  29.21,38.1 0 top
LED1  54.61,52.07 180 top
LED2  20.95,26.67 180 top
LOGO1  27.94,53.34 0 top
LOGO3  28.57,47.24 0 bottom
Q1  31.11,20.95 270 top
R1  54.61,49.53 180 top
R2  25.4,26.67 0 top
R3  34.29,20.95 270 top
R4  43.18,27.94 270 top
R5  52.7,44.45 180 top
R6  18.41,13.97 0 top
R7  40.64,28.57 270 top
R8  44.45,27.94 270 top
R9  50.8,17.78 180 top
R10  48.9,20.95 180 top
R11  48.9,27.94 180 top
R12  12.7,33.66 90 top
R13  41.27,9.53 270 top
R14  42.55,13.34 90 top
R15  41.27,13.34 90 top
R16  40.01,9.53 90 top
R17  15.24,13.97 0 top
R18  57.15,9.53 270 top
R19  48.9,44.45 0 top
R20  45.09,44.45 180 top
R21  7.62,16.51 180 top
R22  7.62,19.05 180 top
R23  7.62,21.59 180 top
R24  7.62,24.13 180 top
R25  7.62,26.67 180 top
R26  7.62,29.21 180 top
R27  7.62,31.75 180 top
R28  7.62,34.29 180 top
R29  7.62,36.83 180 top
R30  7.62,39.37 180 top
R31  7.62,41.91 180 top
R32  7.62,44.45 180 top
R33  7.62,46.99 180 top
R34  7.62,49.53 180 top
R35  7.62,13.97 180 top
R36  7.62,11.43 180 top
R37  7.62,52.07 180 top
R38  7.62,54.61 180 top
R39  54.61,9.53 90 top
S1  19.05,57.15 0 top
S2  34.29,5.08 90 top
SJ1  7.3,3.81 0 top
SJ2  55.88,6.35 180 top
SJ3  41.27,6.35 0 top
SJ4  55.88,14.61 180 top
U1  34.29,38.1 180 top
U2  35.56,46.35 0 top
U3  17.78,38.1 0 top
U4  19.05,20.32 0 top
U5  31.75,27.94 270 top
U7  40.64,20.32 180 top
U9  1.27,53.34 270 top
U10  3.81,53.34 270 top
U$1  40.38,49.1 0 bottom
U$4  7.62,-19.05 0 top  (outside the outline)
U$12  55.88,2.54 0 top
U$13  2.54,2.54 0 top
U$14  2.54,59.69 0 top
U$15  55.88,59.69 0 top

### Tracks (layer width: path | path; a pad name or v marks a point on that pad's centre or on a via)
3.3V  (via drill 0.51)
  Top 0.203: 43.05,20.57 v43.05,20.6 43.08,20.57 | 31.75,27.43 31.75,25.91 32.38,25.27 33.02,25.27 35.72,22.57 U7.14 | 31.62,27.3 31.75,27.43 | 31.75,27.43 31.75,28.3 31.46,28.59 U5.1 | U7.38 41.43,18.07 | 41.39,22.57 U7.14 | U7.14 38.1,22.57 38.1,20.57 37.59,20.07 U7.19 | U7.6 40.89,24.13
  Top 0.254: C3.A 20.45,20.45 19.05,19.05 U4.2 19.05,14.19 R6.2 19.27,13.55 19.28,13.54 19.28,13.16 18.82,12.7 v13.97,12.7 13.97,7.75 13.46,7.24 8.13,7.24 6.48,5.59 6.48,3.82 SJ1.1 | 26.67,20.32 C2.1 25.95,19.9 25.4,20.45 C3.A | 31.62,27.3 30.94,27.3 U5.3 | 41.39,18.03 U7.32 | 41.39,20.57 | 41.39,20.57 41.39,20.27 | 41.39,20.27 41.39,18.03 | 41.39,20.57 41.39,22.57 41.39,22.87 40.89,23.37 40.89,24.13 U7.6 | 41.39,20.57 | 41.39,18.03 41.43,18.07 | R19.2 R5.2 51.85,46.77 52.07,46.99 v53.34,46.99 53.34,48.01 53.85,48.51 53.85,49.44 R1.2 49.53,49.53 43.93,55.13 U2.4 | U3.24 14.21,42.4 14.22,42.41 14.22,43.18 14.01,43.4 C4.1 11.9,43.4 11.43,42.93 v11.43,41.91 | U5.1 28.59,28.59 27.74,27.74 27.74,27.2 27.2,26.67 R2.2 26.25,24.98 24.13,22.86 C3.A | 41.39,20.07 41.39,20.27 | U1.28 25.4,43.94 25.65,44.2 25.65,45.05 C1.1 25.61,46.14 25.4,46.35 22.23,46.35 v21.59,45.72 | R12.2 11.92,34.51 11.4,33.98 11.4,31.09 v10.79,30.48 | 41.39,20.57 43.05,20.57 | v43.05,20.6 43.05,21.11 43.52,21.57 U7.45 45.98,21.57 47.3,22.89 47.3,23.04 47.54,23.28 C6.1 | U7.43 43.08,20.57
  Bottom 0.254: v21.59,45.72 13.97,45.72 11.43,43.18 v11.43,41.91 13.97,39.37 13.97,30.48 | v43.05,20.6 43.05,22.73 45.72,25.4 50.8,25.4 52.07,24.13 54.61,24.13 55.88,25.4 55.88,45.72 54.61,46.99 v53.34,46.99 | v13.97,12.7 13.97,30.48 | 13.97,30.48 v10.79,30.48
COM  (via drill 0.51)
  Top 0.254: U1.3 27.94,35.06 27,36 23.69,36 v22.86,36.83 | v19.05,36.83 18.22,36 14.8,36 14.21,35.41 U3.1 14.21,33.26 13.76,32.8 R12.1
  Bottom 0.254: v19.05,36.83 v22.86,36.83
CVDD  (via drill 0.51)
  Top 0.254: C8.1 38.1,26.67 38.61,26.16 v40.39,26.16 | U7.24 39.88,17.57 | 39.88,17.57 40.47,17.57 40.89,17.14 U7.31 | 39.88,17.57 v39.88,18.8 | U7.7 v40.39,26.16 | U7.5 41.39,25.92 41.15,26.16 v40.39,26.16 | C8.1 37.76,27.73 | U5.5 33.62,28.59 33.96,28.25 33.96,26.9 34.32,26.54 C7.A 36.73,26.54 36.88,26.7 36.88,27.33 37.26,27.71 38.09,27.71 C8.1
  Bottom 0.254: v39.88,18.8 39.88,25.78 40.26,26.16 v40.39,26.16
FCS
  Top 0.254: U1.17 39.37,44.58 39.75,44.96 39.75,52.83 41.78,54.86 U2.2
FDI
  Top 0.254: U1.18 38.1,44.45 38.86,45.21 38.86,58.04 39.75,58.93 42.04,58.93 42.79,58.17 42.79,57.25 U2.3
FDO
  Top 0.254: U1.11 38.1,32 38.73,31.37 43.81,31.37 44.7,30.48 46.99,30.48 48.26,31.75 48.26,38.1 53.55,43.4 R5.1 55.24,44.45 57.66,46.86 57.66,54.1 56.52,55.24 48.01,55.24 47.21,56.04 U2.7
FSCK  (via drill 0.51)
  Top 0.254: U1.10 36.83,35.18 37.19,35.53 v37.34,35.53 | v37.72,45.72 37.72,58.29 39.12,59.69 43.69,59.69 44.98,58.4 U2.5
  Bottom 0.254: v37.34,35.53 37.34,36.07 38.1,36.83 38.1,45.34 v37.72,45.72
GBUF
  Top 0.203: 48.03,20.97 R10.2
  Top 0.254: U7.42 46.1,20.07 46.99,20.95 R10.2 48.01,20.99 | 48.03,20.97 48.03,21.67 48.21,21.84 54.41,21.84 55.07,21.18 SJ4.3
GND  (via drill 0.51)
  Top 0.203: 45.87,23.57 45.74,23.7 | 45.9,23.67 45.87,23.7 | U7.35 42.89,17.49 | U7.37 43.39,17.57 | U7.41 43.32,19.57 v43.05,19.3 43.29,19.07 U7.40 | U7.47 45.56,22.57 45.97,22.99 45.97,23.44 45.74,23.67 | U7.4 41.89,23.39 41.91,23.37 | U7.22 34.42,18.57 | U7.20 35.31,19.57 35.31,19.68 | U7.16 35.58,21.57 35.28,21.87 35.28,22.4 34.19,23.5 33.45,23.5 | U7.21 35.06,19.07 arc-90 35.03,19.1
  other vias: 39.37,28.57 44.58,33.15 44.58,50.93 22.86,33.02 31.75,40.13 22.3,44.46 11.3,39.41 12.32,11.94 26.67,29.34 47.55,26.52 48.26,19.05
  pour Bottom (isolate 0.305): 0,62.23 58.42,62.23 58.42,0 0,0
  pour Top (isolate 0.305): 0,62.23 58.42,62.23 58.42,0 0,0
LEFT  (via drill 0.51)
  Top 0.203: U7.46 45.84,22.07 46.63,22.86 46.63,27.58 46.99,27.94 R11.2 | 48.05,27.5 48.07,27.47
  Top 0.254: v51.16,23.19 51.16,25.55 49.86,26.85 48.53,26.85 48.07,27.3 48.07,27.47 | 48.05,27.5 R11.2 | SJ2.3 54.15,6.35 52.48,8.03 52.48,9.58 53.57,10.67 53.57,12.19 53.75,12.37 v54.25,12.37 54.94,12.37 55.88,11.43 C16.1
  Bottom 0.254: v51.16,23.19 54.25,20.09 v54.25,12.37
MCS  (via drill 0.51)
  Top 0.254: v33.02,44.58 U1.22 | U7.23 34.96,18.07 34.29,17.4 v34.29,12.7
  Bottom 0.254: v34.29,12.7 34.29,13.97 29.21,19.05 29.21,31.75 33.02,35.56 v33.02,44.58
MDCS  (via drill 0.51)
  Top 0.254: v33.02,30.48 U1.7 | U7.13 36.39,23.93 v36.32,24
  Bottom 0.254: v36.32,24 36.32,27.18 v33.02,30.48
MDREQ  (via drill 0.51)
  Top 0.254: U7.8 39.89,25.39 39.62,25.65 37.72,25.65 36.96,24.89 34.54,24.89 v33.27,26.16 | U1.20 35.56,44.07 36.2,44.7 v36.83,44.7
  Bottom 0.254: v33.27,26.16 33.27,28.45 32,29.72 32,30.99 35.56,34.54 35.56,43.43 v36.83,44.7
MICN
  Top 0.203: 43.18,26.67 43.18,26.26 42.9,25.98 42.9,24.58 U7.2
  Top 0.254: 43.18,26.67 R4.2
MICP
  Top 0.254: U7.1 43.39,25.48 43.69,25.78 44.2,25.78 44.45,26.04 R8.2
MRST  (via drill 0.51)
  Top 0.254: U7.3 42.39,25.81 41.91,26.29 41.91,27.66 | v31.75,44.58 U1.23 | v43.56,30.23 42.93,30.23 41.91,29.21 41.91,27.66 | 41.91,27.66 40.71,27.66 R7.2
  Bottom 0.254: v31.75,44.58 31.75,45.72 34.29,48.26 41.91,48.26 43.56,46.61 v43.56,30.23
MSCLK  (via drill 0.51)
  Top 0.203: v37.52,14.68 37.74,14.91 39.04,14.91 39.37,15.24 39.37,16.05 U7.28
  Top 0.254: v34.29,31.37 U1.8
  Bottom 0.254: v34.29,31.37 34.29,30.48 37.52,27.25 v37.52,14.68
MSI  (via drill 0.51)
  Top 0.254: U7.29 39.89,14.49 39.22,13.82 v38.38,13.82 | v34.29,44.58 U1.21
  Bottom 0.254: v34.29,44.58 36.7,46.99 40.64,46.99 41.91,45.72 41.91,17.78 38.38,14.25 v38.38,13.82
MSO  (via drill 0.51)
  Top 0.254: U7.30 40.39,13.72 v39.37,12.7 | U1.6 31.75,31.24 v30.99,30.48
  Bottom 0.254: v39.37,12.7 36.83,12.7 30.99,18.54 v30.99,30.48
N$1
  Top 0.203: SJ4.2 55.88,13.72 55.63,13.46 50.16,13.46 49.86,13.16 49.86,5.64 51.71,3.79 JP2.SLEEVE
N$2
  Top 0.254: R6.1 R17.2 16.09,14.74 16.74,15.39 U4.1
N$3
  Top 0.203: 34.81,20.57 34.34,20.11 R3.2 34.29,19.36 34.04,19.11 Q1.3 32.27,17.89 31.95,17.58 31.95,16.52 C9.2
  Top 0.254: 34.81,20.57 U7.18
N$4
  Top 0.254: LED1.A 56.11,51.03 55.46,50.38 R1.1
N$5
  Top 0.203: R3.1 34.31,21.78 34.31,21.16 34.23,21.07 | Q1.1 29.96,21.34 30.25,21.06 34.21,21.06 34.23,21.07 | U7.17 34.23,21.07
  Top 0.254: Q1.1 29.26,22.8 28.85,22.4 28.85,22.3 28.56,22.01 C10.2
N$6
  Top 0.254: SJ3.2 41.27,5.08 42.05,4.3 JP2.RING
N$7
  Top 0.254: SJ3.1 40.46,7.19 41.27,8 R13.2
N$8
  Top 0.254: R16.2 R13.1 C15.2
N$9
  Top 0.254: R2.1 LED2.A
N$10
  Top 0.203: U7.34 42.39,15.42 42.55,15.27 R14.2
N$11
  Top 0.203: 49.53,22.86 C11.2
  Top 0.254: U7.44 46.37,21.07 47.65,22.35 49.4,22.35 49.53,22.48 C11.2
N$12
  Top 0.254: U1.5 30.48,31.75 29.21,30.48 21.59,30.48 19.68,28.57 19.68,26.9 LED2.C
N$13
  Top 0.254: S2.2 29.21,5.08 27.94,6.35 17.78,6.35 14.73,3.3 J1.VIN0
N$14
  Top 0.254: R11.1 C14.1
N$15
  Top 0.254: R10.1 C13.1
N$16
  Top 0.254: R9.1 C12.1
N$17
  Top 0.203: U7.33 41.89,15.42 41.27,14.81 R15.2
N$18
  Top 0.254: U4.3 21.34,17.2 21.34,15.88 21.84,15.37 C5.A 28.42,15.37 29.06,14.73 F1.2
N$19
  Top 0.254: SJ2.2 55.88,5.59 55.5,5.21 54.48,5.21 51.71,7.98 JP2.TIP
N$20  (via drill 0.51)
  Top 0.254: v15.24,6.35 8.26,6.35 7.3,5.4 SJ1.2 | S2.6 37.12,8.61 v35.56,10.16
  Bottom 0.254: v15.24,6.35 26.67,6.35 30.48,10.16 v35.56,10.16
N$22
  Top 0.203: R39.2 54.55,10.31
  Top 0.254: 54.55,10.31 53.87,10.31 53.54,9.98 53.54,8.03 53.95,7.62 56.52,7.62 56.69,7.44 SJ2.1
N$23
  Top 0.203: R18.2 C16.2 R39.1
RIGHT
  Top 0.254: SJ3.3 42.09,7.16 42.55,7.62 C15.1 44.23,8.68 44.84,9.29 44.84,16.14 46.48,17.78 46.8,17.78 | 46.8,17.78 R9.2 | U7.39 46.65,18.57 46.8,18.41 46.8,17.78
RX
  Top 0.254: U1.16 40.64,43.94 41.15,44.45 R20.2 44.23,45.12 44.7,45.59 46.9,45.59 R19.1
RX-I  (via drill 0.51)
  Top 0.254: v46.99,41.91 45.94,42.97 R20.1
  Bottom 0.254: JP3.3 46.99,38.1 v46.99,41.91
S0  (via drill 0.51)
  Top 0.254: U1.26 27.94,40.94 v26,39 | U3.10 20.05,39.76 v20,39.81
  Bottom 0.254: v26,39 20.81,39 v20,39.81
S1
  Top 0.254: U1.2 26.67,32.13 26.04,31.5 21.97,31.5 20.7,32.76 U3.11
S2
  Top 0.254: U1.27 26.67,41.91 25.4,40.64 24.13,40.64 23,41.77 23,43 22.69,43.31 21.08,43.31 20.7,42.93 U3.14
S3
  Top 0.254: U1.1 24.45,33.55 21.36,36.65 U3.13
SW1
  Top 0.254: S1.1 16.55,54.65 17.78,55.88 24.13,55.88 30.48,49.53 30.48,45.72 30.48,44.45 U1.24
SW2  (via drill 0.51)
  Top 0.254: U1.4 29.21,34.79 27,37 26,37 v25,38 | S1.T 19.05,50.95 v21,49
  Bottom 0.254: v25,38 27,38 28,39 28,43 22,49 v21,49
SW3
  Top 0.254: S1.2 21.55,52.11 29.21,44.45 U1.25
T1
  Top 0.254: R36.2 5.08,11.43 U10.18
T2
  Top 0.254: R35.2 5.08,13.97 U10.17
T3
  Top 0.254: R21.2 5.08,16.51 U10.16
T4
  Top 0.254: R22.2 5.08,19.05 U10.15
T5
  Top 0.254: R23.2 5.08,21.59 U10.14
T6
  Top 0.254: R24.2 5.08,24.13 U10.13
T7
  Top 0.254: R25.2 5.08,26.67 U10.12
T8
  Top 0.254: R26.2 5.08,29.21 U10.11
T9
  Top 0.254: R27.2 5.08,31.75 U10.10
T10
  Top 0.254: R28.2 5.08,34.29 U10.9
T11
  Top 0.254: R29.2 5.08,36.83 U10.8
T12
  Top 0.254: R30.2 5.08,39.37 U10.7
T13
  Top 0.254: R31.2 5.08,41.91 U10.6
T14
  Top 0.254: R32.2 5.08,44.45 U10.5
T15
  Top 0.254: R33.2 5.08,46.99 U10.4
T16
  Top 0.254: R34.2 5.08,49.53 U10.3
T17
  Top 0.254: U10.2 5.08,52.07 R37.2
T18
  Top 0.254: R38.2 5.08,54.61 U10.1
TRIG1
  Top 0.254: U3.9 19.41,29.57 15.24,25.4 15.24,17.14 9.53,11.43 R36.1
TRIG2
  Top 0.254: U3.8 18.75,29.8 14.48,25.53 14.48,17.65 10.79,13.97 R35.1
TRIG3
  Top 0.254: U3.7 18.11,30.04 13.72,25.65 13.72,18.8 11.43,16.51 R21.1
TRIG4
  Top 0.254: U3.6 17.45,30.41 12.83,25.78 12.83,21.21 10.67,19.05 R22.1
TRIG5
  Top 0.254: U3.5 16.8,30.77 11.94,25.91 11.94,22.73 10.79,21.59 R23.1
TRIG6
  Top 0.254: U3.4 16.16,31.14 11.05,26.04 11.05,24.89 10.29,24.13 R24.1
TRIG7
  Top 0.254: U3.3 15.51,32.02 10.16,26.67 R25.1
TRIG8
  Top 0.254: U3.2 14.86,32.63 11.43,29.21 R26.1
TRIG9  (via drill 0.51)
  Top 0.254: U3.23 14.86,40.26 13.97,39.37 v12.7,39.37 | R27.1 v10.16,31.75
  Bottom 0.254: v12.7,39.37 12.7,39.24 13.26,38.68 13.26,33.58 11.43,31.75 v10.16,31.75
TRIG10  (via drill 0.51)
  Top 0.254: U3.22 15.51,38.37 15.24,38.1 v12.27,38.1 | R28.1 v10.16,34.29
  Bottom 0.254: v12.27,38.1 12.27,35.13 11.43,34.29 v10.16,34.29
TRIG11
  Top 0.254: U3.21 16.16,37.74 15.24,36.83 R29.1
TRIG12
  Top 0.203: U3.20 16.8,42.99 15.04,44.76 12.55,44.76 10.39,42.6 10.39,39.7 10.06,39.37 R30.1
TRIG13
  Top 0.203: U3.19 17.45,43.38 15.62,45.21 12.19,45.21 9.65,42.67 9.65,42.29 9.27,41.91 R31.1
  Top 0.254: 8.89,41.91 R31.1
TRIG14
  Top 0.254: U3.18 18.11,44.12 16.51,45.72 11.43,45.72 10.16,44.45 R32.1
TRIG15
  Top 0.254: U3.17 18.75,44.74 16.51,46.99 R33.1
TRIG16
  Top 0.254: U3.16 19.41,46.63 16.51,49.53 R34.1
TRIG17  (via drill 0.51)
  Top 0.254: v29.21,40.64 27.56,38.99 27.56,37.21 28.19,36.58 35.18,36.58 35.56,36.96 35.56,38.86 36.32,39.62 37.72,39.62 39.24,38.1 JP9.5 41.91,40.64 U1.15 | R37.1 v11.43,52.07
  Bottom 0.254: v29.21,40.64 29.21,45.72 22.86,52.07 v11.43,52.07
TRIG18  (via drill 0.51)
  Top 0.254: JP9.4 36.83,36.42 36.85,36.4 | v30.48,35.56 35.64,35.56 36.47,36.4 36.85,36.4 | R38.1 v10.79,54.61 | U1.13 40.64,35.18 39.42,36.4 36.85,36.4
  Bottom 0.254: v30.48,35.56 30.48,48.26 24.13,54.61 v10.79,54.61
TX  (via drill 0.51)
  Top 0.254: v45.47,32 39.75,32 39.37,32.38 U1.12
  Bottom 0.254: JP3.2 48.26,29.21 v45.47,32
USBVCC  (via drill 0.51)
  Top 0.254: JP3.4 54.61,34.29 55.88,33.02 v55.88,22.86 | v38.73,5.08 S2.5
  Bottom 0.254: v38.73,5.08 50.8,5.08 55.88,10.16 v55.88,22.86
VBUS
  Top 0.254: JP5.2 19.3,10.41 21.59,12.7 24.13,12.7 26.67,10.16 30.48,10.16 | 30.48,10.16 31.75,10.16 32.89,9.02 32.89,4.06 31.46,2.64 S2.1 31.46,1.75 30.61,0.89 9.27,0.89 8.13,2.03 8.13,3.8 SJ1.3 | F1.1 30.48,10.16
  Bottom 0.254: JP9.1 29.21,34.29 19.05,24.13 JP5.2
XRES
  Top 0.254: JP9.3 34.29,38.73 36.83,41.27 U1.19

### Text on the board
Bottom: V24
tPlace: TRIG18 | Power | TRIG17 | MP3 Trigger | TRIG16 | robertsonics | TRIG15 | TRIG14 | BLK | TRIG13 | GND | TRIG12 | TRIG11 | VCC | TRIG10 | RX | TRIG9 | 5V FTDI | TX | Status | TRIG8 | TRIG7 | GRN | TRIG6 | TRIG5 | TRIG4 | Audio / GND | TRIG3 | TRIG2 | 4.5-12V | TRIG1 | USB | 3.3V | VBUS | Audio / Left | EXT | Audio / Right
bPlace: Solder Jumper Key | Line out / (AC - default) | Input Voltage: | Headphone / out (DC) | 4.5 - 12V
tDocu: Jamie Robertson | Joel Bartlett